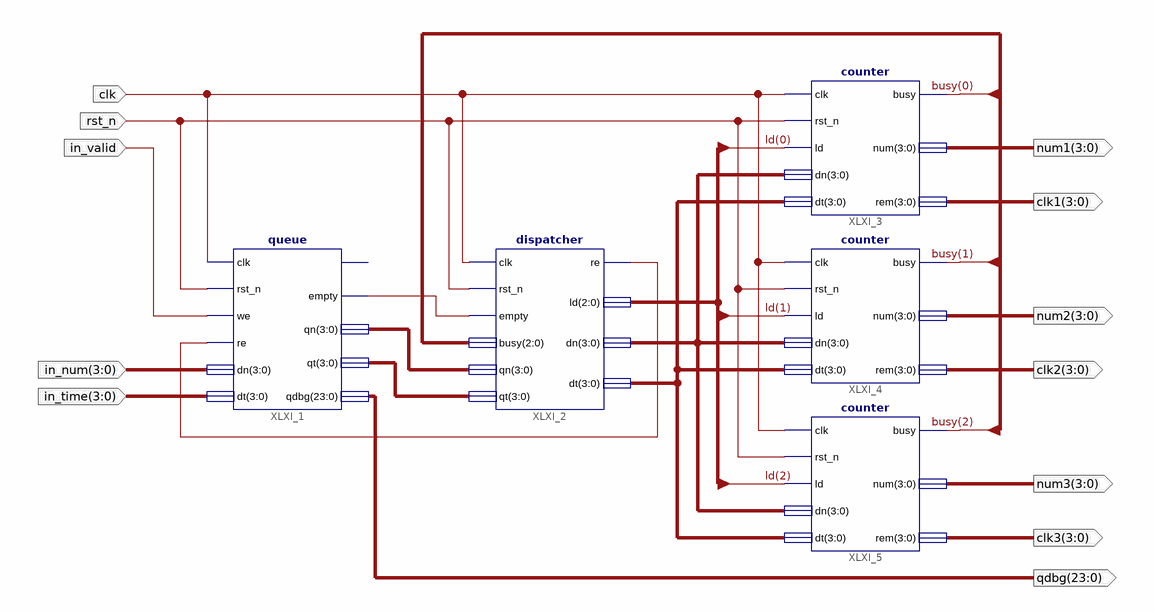
[diagram p0: schematic sheet 1]
// Xilinx ISE schematic top_draw.sch (xc9500) as structural Verilog: 5 symbols, 12 ports
module top_draw (
  input  in_valid,
  input  rst_n,
  input  [3:0] in_num,
  input  [3:0] in_time,
  input  clk,
  output [23:0] qdbg,
  output [3:0] clk3,
  output [3:0] num3,
  output [3:0] clk2,
  output [3:0] num2,
  output [3:0] clk1,
  output [3:0] num1
);

  wire XLXN_3, XLXN_5;
  wire [2:0] busy, ld, XLXN_6, XLXN_10;
  wire [3:0] XLXN_1, XLXN_2, XLXN_18, XLXN_21;

  queue XLXI_1 (
    .clk(clk), .rst_n(rst_n), .we(in_valid), .re(XLXN_5), .dn(in_num), .dt(in_time), .empty(XLXN_3),
    .qn(XLXN_1), .qt(XLXN_2), .qdbg(qdbg));  // open: full
  dispatcher XLXI_2 (
    .clk(clk), .rst_n(rst_n), .empty(XLXN_3), .busy(XLXN_6), .qn(XLXN_1), .qt(XLXN_2), .re(XLXN_5),
    .ld(XLXN_10), .dn(XLXN_21), .dt(XLXN_18));
  counter XLXI_5 (
    .clk(clk), .rst_n(rst_n), .ld(ld[2]), .dn(XLXN_21), .dt(XLXN_18), .busy(busy[2]), .num(num3), .rem(clk3));
  counter XLXI_4 (
    .clk(clk), .rst_n(rst_n), .ld(ld[1]), .dn(XLXN_21), .dt(XLXN_18), .busy(busy[1]), .num(num2), .rem(clk2));
  counter XLXI_3 (
    .clk(clk), .rst_n(rst_n), .ld(ld[0]), .dn(XLXN_21), .dt(XLXN_18), .busy(busy[0]), .num(num1), .rem(clk1));
endmodule
